# Altium schematic sheet pca10040_sheet1_cover.SchDoc: PCA10040 - Cover
size A3; Organization: Nordic Semiconductor; DocumentNumber: 1; Revision: 1.2.1; SheetNumber: 1; SheetTotal: 7; CompanyName: Nordic Semiconductor; DrawnBy: KJP/RUBR; ProjectNumber: 4397; DocumentSize: A3; PCBRevision: 0256RUBR; PCAName: PCA10040; PCBNumber: 400150; ProjectName: Quark
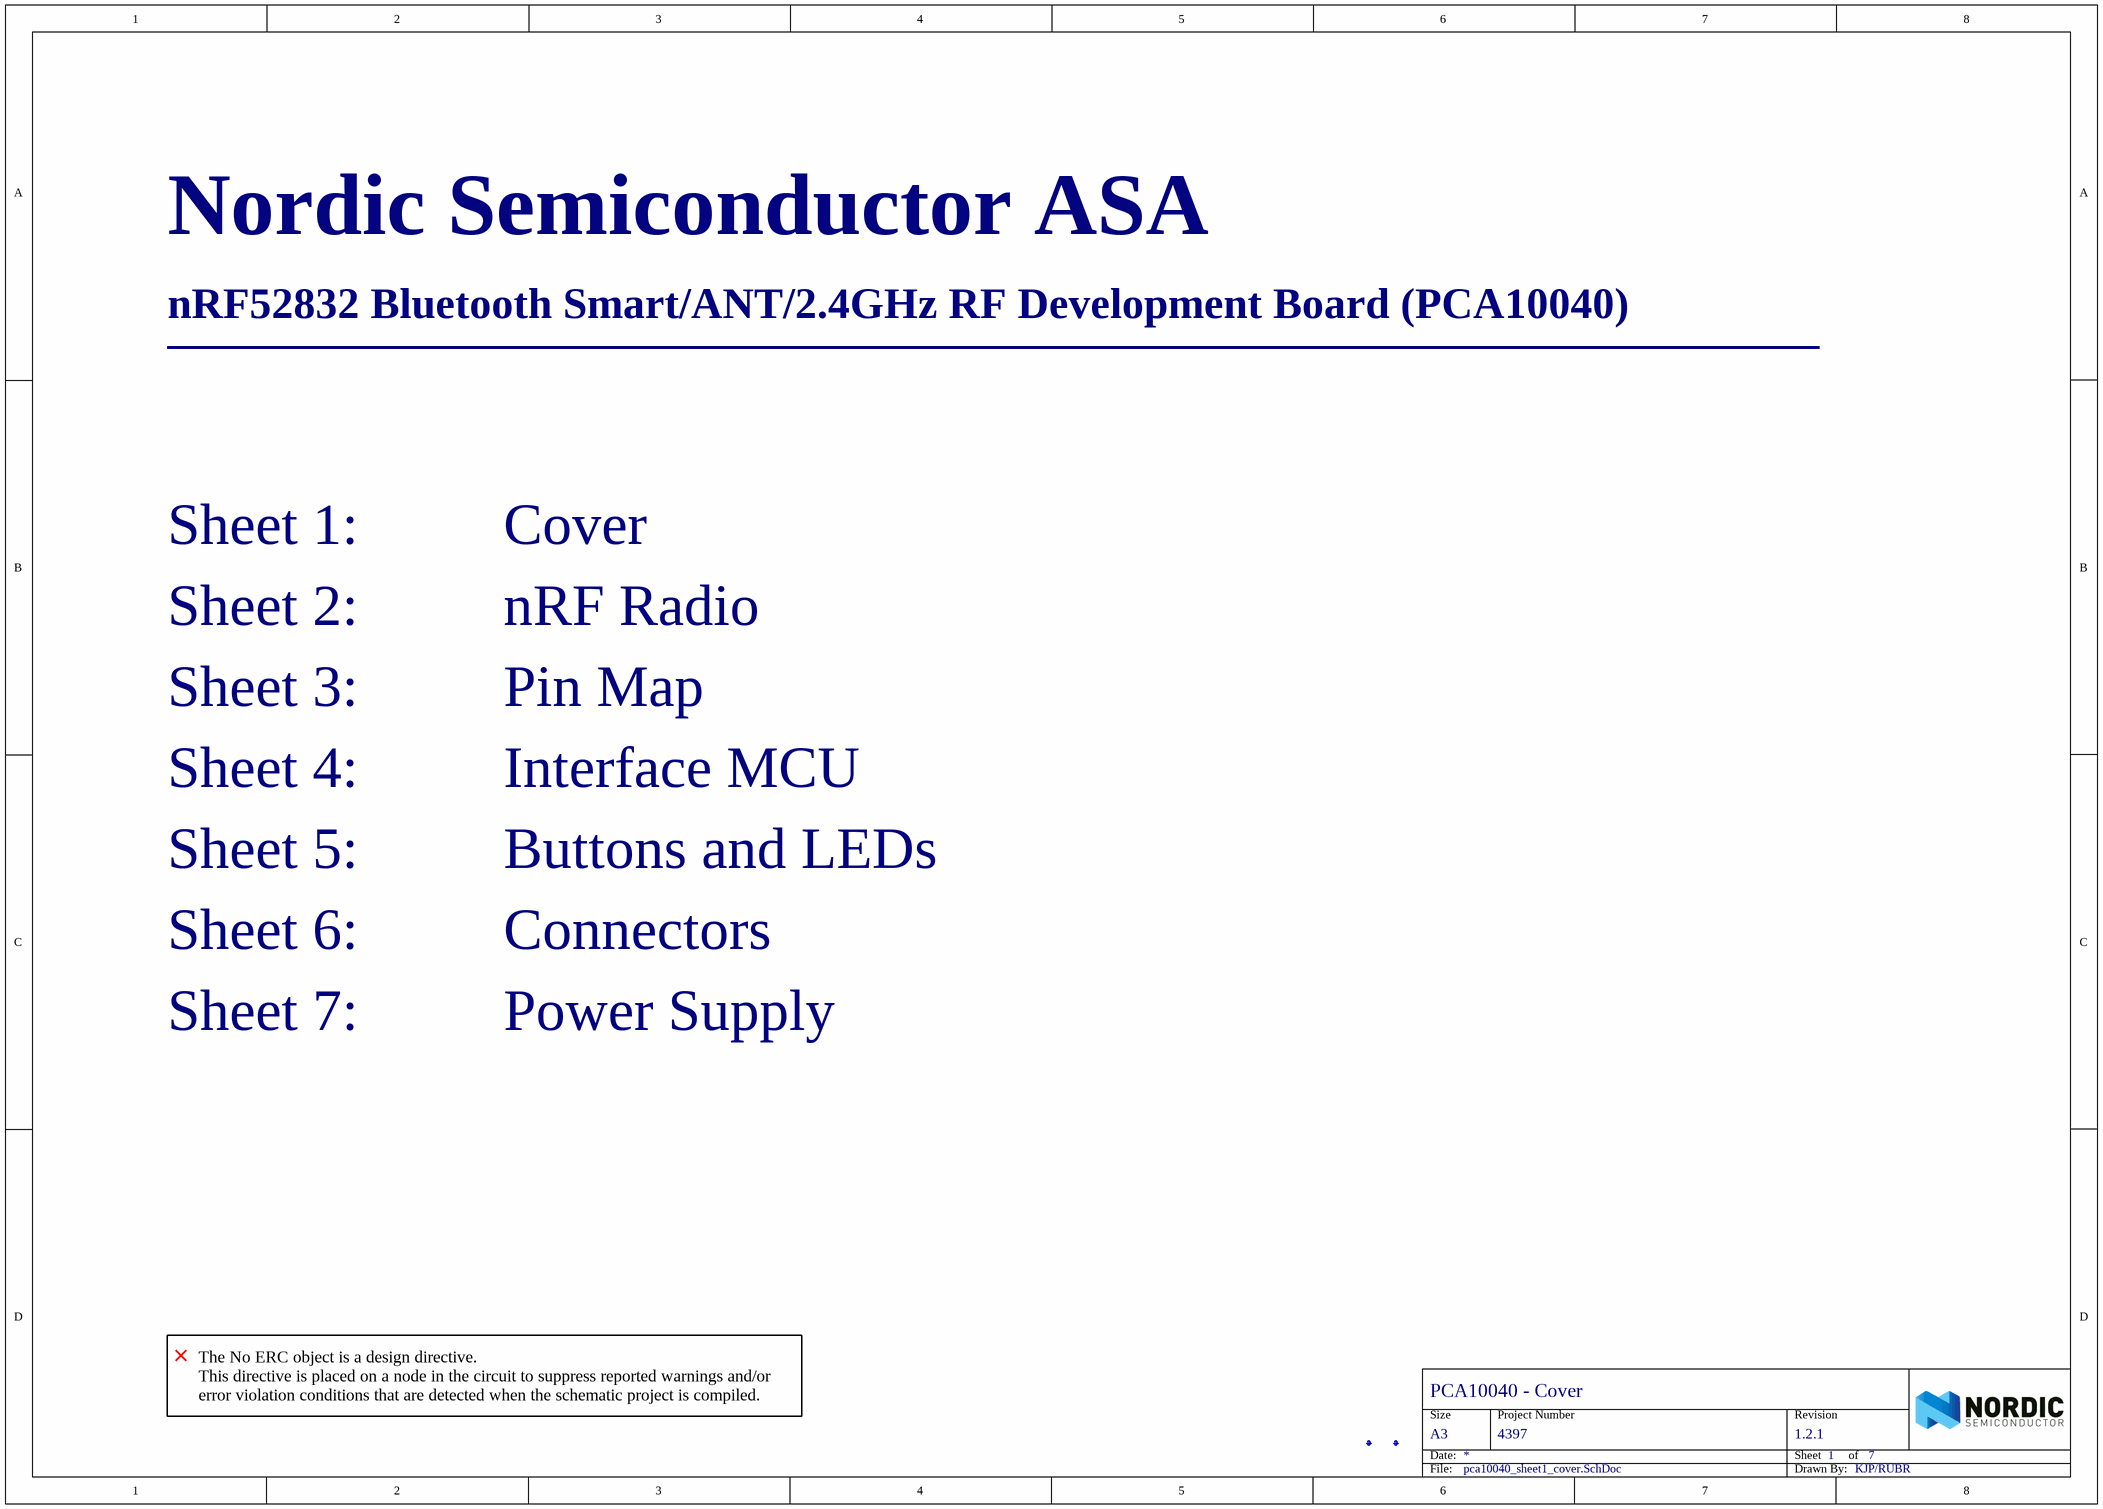
[diagram p0: pca10040_sheet1_cover.SchDoc]

## Parts
Fid1  Fiducial mark  [Fiducial]  (value not drawn)
Fid2  Fiducial mark  [Fiducial]  (value not drawn)

## Notes on the sheet
- Nordic Semiconductor ASA
- nRF52832 Bluetooth Smart/ANT/2.4GHz RF Development Board (PCA10040)
- ________________________________________________________
- Sheet 1:          Cover
- Sheet 2:          nRF Radio
- Sheet 3:          Pin Map
- Sheet 4:          Interface MCU
- Sheet 5:          Buttons and LEDs
- Sheet 6:          Connectors
- Sheet 7:          Power Supply
- The No ERC object is a design directive.
  This directive is placed on a node in the circuit to suppress reported warnings and/or error violation conditions that are detected when the schematic project is compiled.
- Size
- Date:
- Project Number
- Sheet         of
- Revision
- File:
- Drawn By:

## Library data of the parts
Fid1 Fid2 = Fid-Mark: Artikkelnr Noca: N.A.; Part Number: Fid-Mark; Manufacturer: *; Manufacturer Part Number: *; Datasheet: *; LatestRevisionDate: 2009-12-12; Pin Count: 1; Publisher: Nordic Semiconductor; Published: 2009-12-12; Value: *; Note: *; Supplier: *; Supplier part number: *; 2nd source Supplier: *; 2nd source part number: *; Footprint Doc: Fiducial; Artikkelnr Simpro: N.A.